# EAGLE design navx_micro_4_1 (EAGLE 6.5.0)
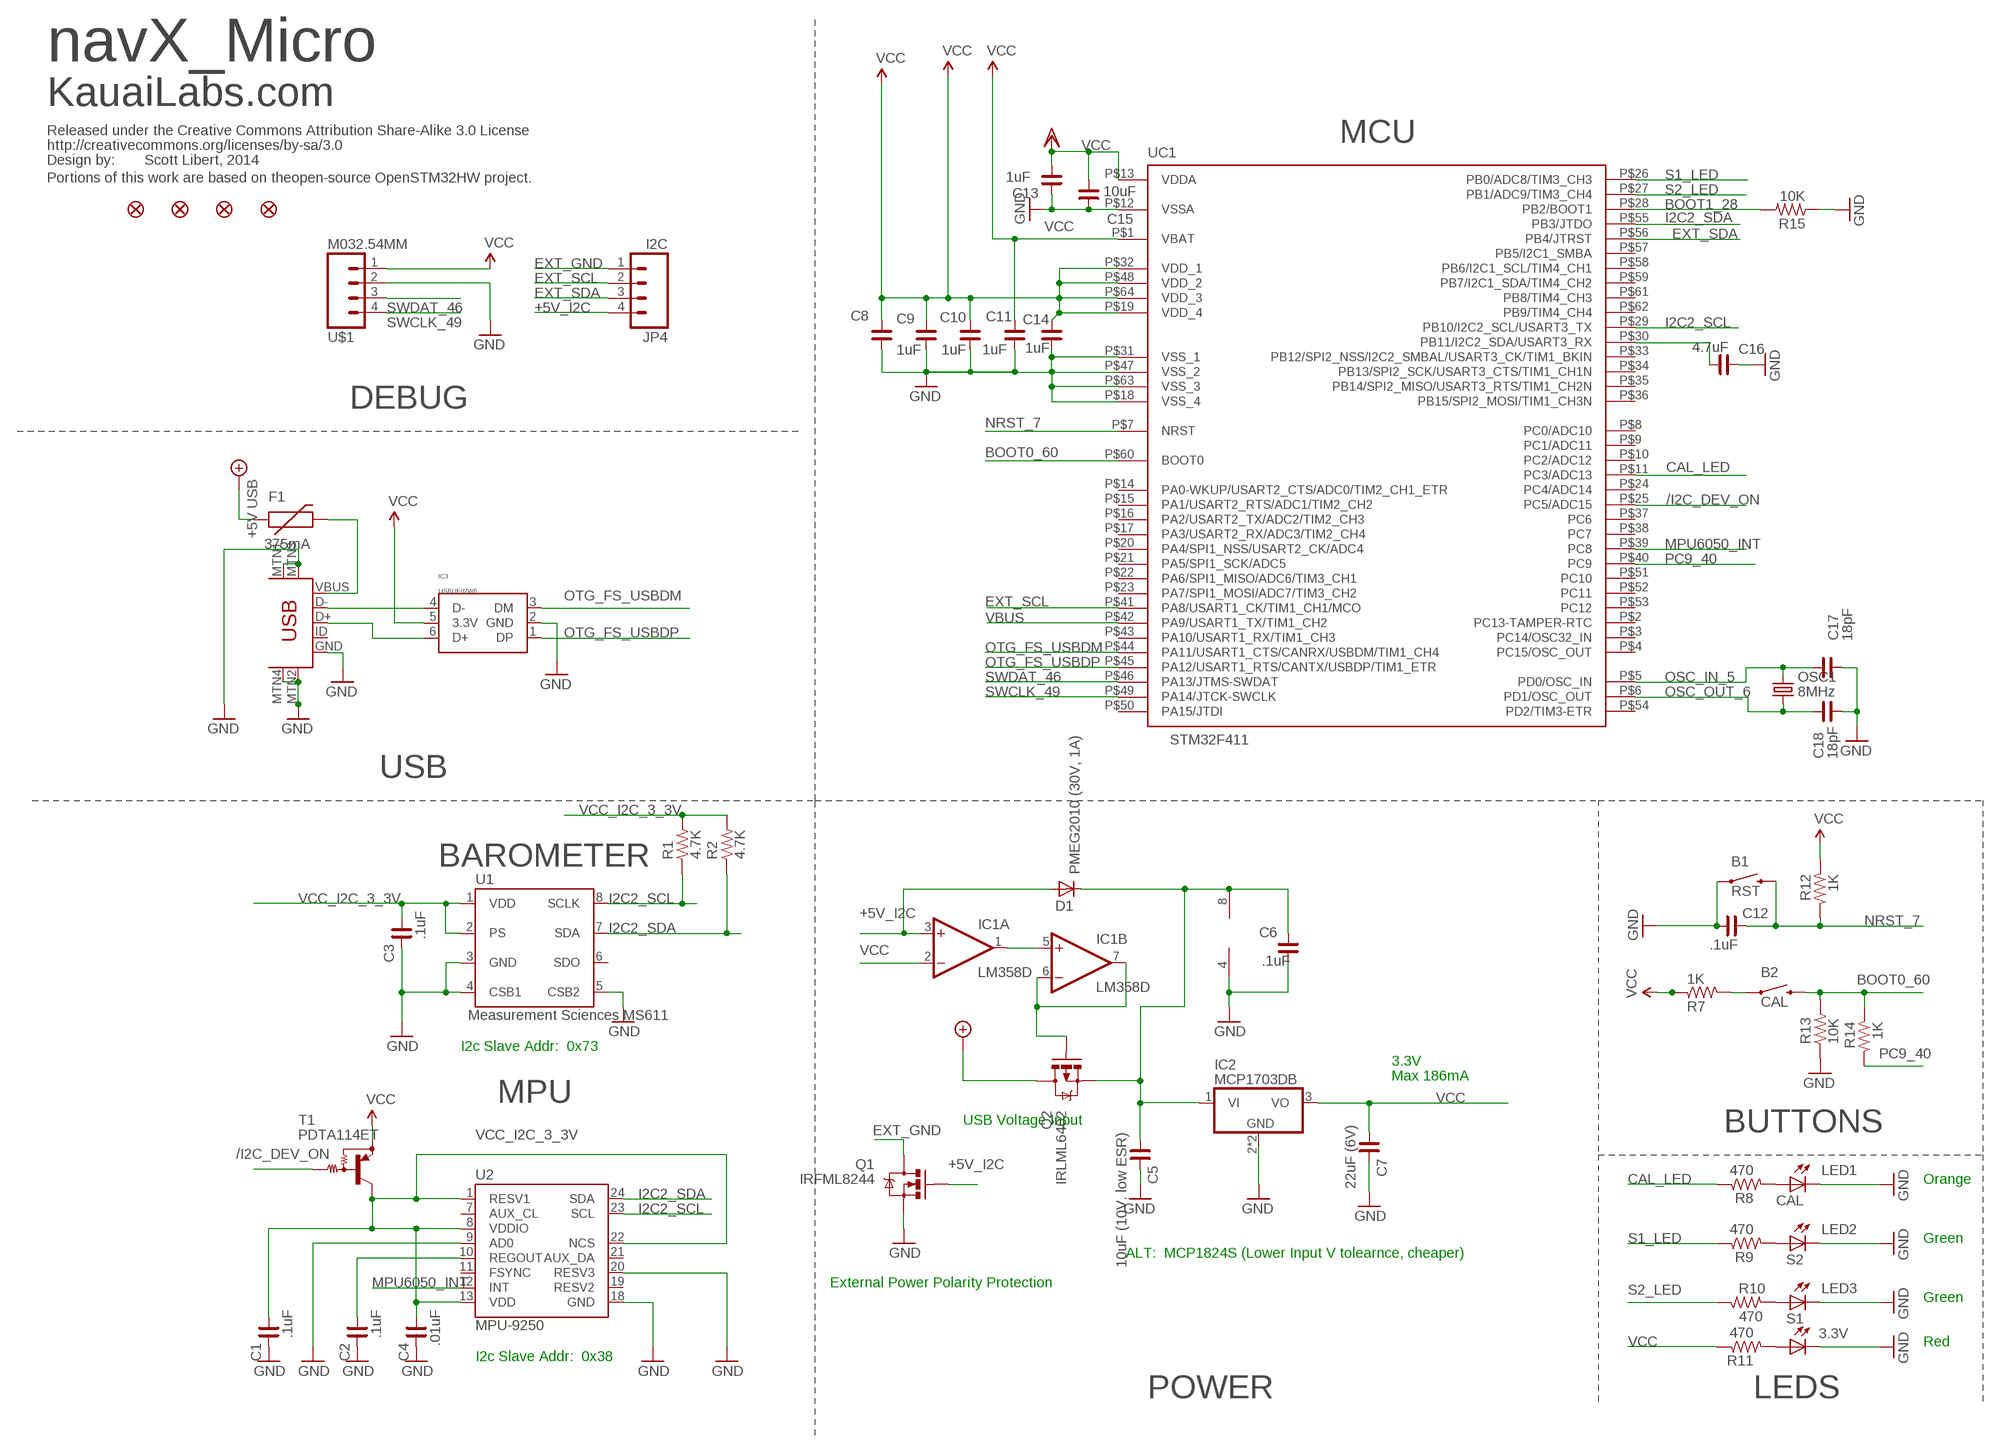
[diagram p0: schematic, sheet 1]

## Parts
B1  RST  SWITCH-MOMENTARY-2-SMD-1101NE  [TACTILE-SWITCH-1101NE]
B2  CAL  SWITCH-MOMENTARY-2-SMD-1101NE  [TACTILE-SWITCH-1101NE]
C1  .1uF  C_0603  [C0603]
C2  .1uF  C_0603  [C0603]
C3  .1uF  C_0603  [C0603]
C4  .01uF  C_0603  [C0603]
C5  10uF (10V. low ESR)  C_0805  [C0805]
C6  .1uF  C_0603  [C0603]
C7  22uF (6V)  C_0805  [C0805]
C8  1uF  C_0603  [C0603]
C9  1uF  C_0603  [C0603]
C10  1uF  C_0603  [C0603]
C11  1uF  C_0603  [C0603]
C12  .1uF  C_0603  [C0603]
C13  1uF  C_0603  [C0603]
C14  1uF  C_0603  [C0603]
C15  10uF  C_0805  [C0805]
C16  4.7uF  C_0603  [C0603]
C17  18pF  C_0603  [C0603]
C18  18pF  C_0603  [C0603]
D1  PMEG2010 (30V, 1A)  DIODESOD-323  [SOD-323]
F1  375mA  PTC0603  [0603]
IC1  LM358D  [SO08]
IC2  MCP1703DB  [MCP1703DB]
IC3  USBUF02W6  [SC70-6]
JP4  I2C  M04PTH  [1X04]
JP21  FIDUCIAL1X2  [FIDUCIAL-1X2]
JP22  FIDUCIAL1X2  [FIDUCIAL-1X2]
JP23  FIDUCIAL1X2  [FIDUCIAL-1X2]
JP24  FIDUCIAL1X2  [FIDUCIAL-1X2]
LED1  CAL  LEDCHIP-LED0603  [CHIP-LED0603]
LED2  S2  LEDCHIP-LED0603  [CHIP-LED0603]
LED3  S1  LEDCHIP-LED0603  [CHIP-LED0603]
LED4  3.3V  LEDCHIP-LED0603  [CHIP-LED0603]
LICENSE_TEXT  CREATIVE_COMMONS  [CREATIVE_COMMONS]
OSC1  8MHz  CRYSTAL5X3  [CRYSTAL-SMD-5X3]
Q1  IRFML8244  MOSFET-NCHANNELBSS123LT1G  [SOT23]
Q2  IRLML6402  MOSFET-PCHANNELSMD  [SOT23-3]
R1  4.7K  R_0603  [R0603]
R2  4.7K  R_0603  [R0603]
R7  1K  R_0603  [R0603]
R8  470  R_0603  [R0603]
R9  470  R_0603  [R0603]
R10  470  R_0603  [R0603]
R11  470  R_0603  [R0603]
R12  1K  R_0603  [R0603]
R13  10K  R_0603  [R0603]
R14  1K  R_0603  [R0603]
R15  10K  R_0603  [R0603]
T1  PDTA114ET  PNP-DRIVERSOT23-3  [SOT23-3]
U1  Measurement Sciences MS611  MS5611  [MS5611]
U2  MPU-9250  [QFN24_3MM_INVENSENSE]
U$1  M032.54MM  M041X04_NO_SILK  [1X04_NO_SILK]
UC1  STM32F411  STM32F103  [TQFP-10X10-64]
USB  Mini-USB  USB-MINIB-5PIN  [USB-MINIB]

## Nets
+5V [vcc]: F1.1 Q2.3(D) ; supply symbol labelled +5V USB
+5V_I2C: D1.A IC1.3(A:+IN) JP4.4 Q1.1(G)
/I2C_DEV_ON: T1.1(B) UC1.P$25(PC5/ADC15)
BOOT0_60: B2.P$2 R13.2 R14.1 UC1.P$60(BOOT0)
BOOT1_28: R15.2 UC1.P$28(PB2/BOOT1)
CAL_LED: R8.1 UC1.P$11(PC3/ADC13)
EXT_GND: JP4.1 Q1.3(D)
EXT_SCL: JP4.2 UC1.P$41(PA8/USART1_CK/TIM1_CH1/MCO)
EXT_SDA: JP4.3 UC1.P$56(PB4/JTRST)
GND: B1.P$1 C1.2 C2.2 C3.2 C4.2 C5.2 C6.1 C7.2 C8.1 C9.1 C10.1 C11.1 C12.1 C13.1 C14.1 C15.2 C16.1 C17.1 C18.1 IC1.4(P:V-) IC2.2(GND) IC2.4(GND) IC3.2(GND) LED1.C LED2.C LED3.C LED4.C Q1.2(S) R13.1 R15.1 U1.3(GND) U1.4(CSB1) U1.5(CSB2) U2.9(AD0) U2.18(GND) U2.20(RESV3) U$1.2 UC1.P$12(VSSA) UC1.P$18(VSS_4) UC1.P$31(VSS_1) UC1.P$47(VSS_2) UC1.P$63(VSS_3) USB.GND USB.MTN1(MTN2) USB.MTN2(MTN3) USB.MTN3(MTN1) USB.MTN4
I2C2_SCL: R1.1 U1.8(SCLK) U2.23(SCL) UC1.P$29(PB10/I2C2_SCL/USART3_TX)
I2C2_SDA: R2.1 U1.7(SDA) U2.24(SDA) UC1.P$55(PB3/JTDO)
MPU6050_INT: U2.12(INT) UC1.P$39(PC8)
N$1: C2.1 U2.10(REGOUT)
N$2: B2.P$1 R7.2
N$3: LED3.A R10.1
N$4: C16.2 UC1.P$30(PB11/I2C2_SDA/USART3_RX)
N$5: LED2.A R9.2
N$7: C5.1 C6.2 D1.C IC1.8(P:V+) IC2.1(VI) Q2.2(S)
N$9: IC1.1(A:OUT) IC1.5(B:+IN)
N$10: IC1.6(B:-IN) IC1.7(B:OUT) Q2.1(G)
N$11: LED1.A R8.2
N$14: IC3.4(D-) USB.D-
N$17: IC3.6(D+) USB.D+
N$18: LED4.A R11.2
NRST_7: B1.P$2 C12.2 R12.2 UC1.P$7(NRST)
OSC_IN_5: C17.2 OSC1.3 UC1.P$5(PD0/OSC_IN)
OSC_OUT_6: C18.2 OSC1.1 UC1.P$6(PD1/OSC_OUT)
OTG_FS_USBDM: IC3.3(DM) UC1.P$44(PA11/USART1_CTS/CANRX/USBDM/TIM1_CH4)
OTG_FS_USBDP: IC3.1(DP) UC1.P$45(PA12/USART1_RTS/CANTX/USBDP/TIM1_ETR)
PC9_40: R14.2 UC1.P$40(PC9)
S1_LED: R9.1 UC1.P$26(PB0/ADC8/TIM3_CH3)
S2_LED: R10.2 UC1.P$27(PB1/ADC9/TIM3_CH4)
SWCLK_49: U$1.4 UC1.P$49(PA14/JTCK-SWCLK)
SWDAT_46: U$1.3 UC1.P$46(PA13/JTMS-SWDAT)
VBUS: F1.2 UC1.P$42(PA9/USART1_TX/TIM1_CH2) USB.VBUS
VCC [vcc]: C7.1 C8.2 C9.2 C10.2 C11.2 C13.2 C14.2 C15.1 IC1.2(A:-IN) IC2.3(VO) IC3.5(3.3V) R7.1 R11.1 R12.1 T1.2(E) U$1.1 UC1.P$1(VBAT) UC1.P$13(VDDA) UC1.P$19(VDD_4) UC1.P$32(VDD_1) UC1.P$48(VDD_2) UC1.P$64(VDD_3) ; supply symbol labelled VDD
VCC_I2C_3_3V [vcc]: C1.1 C3.1 C4.1 R1.2 R2.2 T1.3(C) U1.1(VDD) U1.2(PS) U2.1(RESV1) U2.8(VDDIO) U2.13(VDD) U2.22(NCS)
Unconnected: U1.6(SDO) U2.7(AUX_CL) U2.11(FSYNC) U2.19(RESV2) U2.21(AUX_DA) UC1.P$2(PC13-TAMPER-RTC) UC1.P$3(PC14/OSC32_IN) UC1.P$4(PC15/OSC_OUT) UC1.P$8(PC0/ADC10) UC1.P$9(PC1/ADC11) UC1.P$10(PC2/ADC12) UC1.P$14(PA0-WKUP/USART2_CTS/ADC0/TIM2_CH1_ETR) UC1.P$15(PA1/USART2_RTS/ADC1/TIM2_CH2) UC1.P$16(PA2/USART2_TX/ADC2/TIM2_CH3) UC1.P$17(PA3/USART2_RX/ADC3/TIM2_CH4) UC1.P$20(PA4/SPI1_NSS/USART2_CK/ADC4) UC1.P$21(PA5/SPI1_SCK/ADC5) UC1.P$22(PA6/SPI1_MISO/ADC6/TIM3_CH1) UC1.P$23(PA7/SPI1_MOSI/ADC7/TIM3_CH2) UC1.P$24(PC4/ADC14) UC1.P$33(PB12/SPI2_NSS/I2C2_SMBAL/USART3_CK/TIM1_BKIN) UC1.P$34(PB13/SPI2_SCK/USART3_CTS/TIM1_CH1N) UC1.P$35(PB14/SPI2_MISO/USART3_RTS/TIM1_CH2N) UC1.P$36(PB15/SPI2_MOSI/TIM1_CH3N) UC1.P$37(PC6) UC1.P$38(PC7) UC1.P$43(PA10/USART1_RX/TIM1_CH3) UC1.P$50(PA15/JTDI) UC1.P$51(PC10) UC1.P$52(PC11) UC1.P$53(PC12) UC1.P$54(PD2/TIM3-ETR) UC1.P$57(PB5/I2C1_SMBA) UC1.P$58(PB6/I2C1_SCL/TIM4_CH1) UC1.P$59(PB7/I2C1_SDA/TIM4_CH2) UC1.P$61(PB8/TIM4_CH3) UC1.P$62(PB9/TIM4_CH4) USB.ID

## Notes on the sheet
- navX_Micro
- KauaiLabs.com
- MCU
- Scott Libert, 2014
- Portions of this work are based on theopen-source OpenSTM32HW project.
- DEBUG
- USB
- BAROMETER
- I2c Slave Addr:  0x73
- 3.3V
- Max 186mA
- MPU
- USB Voltage Input
- BUTTONS
- Orange
- Green
- ALT:  MCP1824S (Lower Input V tolearnce, cheaper)
- External Power Polarity Protection
- Green
- Red
- I2c Slave Addr:  0x38
- POWER | LEDS

## Library data of the parts
B1 B2 = SparkFun_20110922_my:SWITCH-MOMENTARY-2
C1 C2 C4 C6 C9-C18 = rc-master-smd:C_: NON-POLARIZED CAP
C3 = rc-master-smd:C_: NON-POLARIZED CAP; DIGIKEY_PART_NUMBER: 399-1096-1-ND
C5 C7 = rc-master-smd:C_: NON-POLARIZED CAP; DIGIKEY_PART_NUMBER: 399-1158-1-ND
C8 = rc-master-smd:C_: NON-POLARIZED CAP; DIGIKEY_PART_NUMBER: 399-3118-1-ND
D1 = adafruit:DIODE: Diode SMADIODE - SMA Surface Mount Package 20V 1A Schottky Diode Digikey: 641-1014-6-ND DO-1N4148 - Through Hole Small Current Diode SOD-123 20V 1 A (.5mV Vf) Schottky Diode - Digikey: MBRX120TPMSCT-ND SOD-323 10V 570mA (.38mV Vf, 3ns) Schottky Diode - Digikey: ZLLS410CT-ND SOD-523 30V 30mA Schottky Diode (RB751S-40TE61) - Digikey: RB751S-40TE61CT-ND SOT23-R/W - SOT23 Package (R = Solder Paste/Reflow Ovens, W = Hand-Soldering) BAT54Film 40V 300mA - Digikey: 497-7162-1-ND
F1 = SparkFun:PTC: Resettable Fuse PTC Resettable Fuse. Spark Fun Electronics SKU : COM-08357
IC1 = linear:LM358: OP AMP also LM158; LM258; LM2904 Source: http://cache.national.com/ds/LM/LM158.pdf
IC2 = KauaiFusionLabs:MCP1703DB; DIGIKEY_PART_NUMBER: MCP1703T-3302E/DBCT-ND
IC3 = es:USBUF; DIGIKEY_PART_NUMBER: 497-3743-1-ND
JP4 U$1 = SparkFun-Connectors:M04: Header 4 Standard 4-pin 0.1" header. Use with straight break away headers (SKU : PRT-00116), right angle break away headers (PRT-00553), swiss pins (PRT-00743), machine pins (PRT-00117), and female headers (PRT-00115). Molex polarized connector foot print use with SKU : PRT-08231 with associated crimp pins and housings. 1MM SMD Version SKU: PRT-10208
JP21-JP24 = SparkFun-Aesthetics:FIDUCIAL: Fiducial Alignment Points Various fiducial points for machine vision alignment.
LED1-LED4 = led:LED: LED OSRAM: - CHIPLED LG R971, LG N971, LY N971, LG Q971, LY Q971, LO R971, LY R971 LH N974, LH R974 LS Q976, LO Q976, LY Q976 LO Q996 - Hyper CHIPLED LW Q18S LB Q993, LB Q99A, LB R99A - SideLED LS A670, LO A670, LY A670, LG A670, LP A670 LB A673, LV A673, LT A673, LW A673 LH A674 LY A675 LS A676, LA A676, LO A676, LY A676, LW A676 LS A679, LY A679, LG A679 - Hyper Micro SIDELED® LS Y876, LA Y876, LO Y876, LY Y876 LT Y87S - SmartLED LW L88C, LW L88S LB L89C, LB L89S, LG L890 LS L89K, LO L89K, LY L89K LS L896, LA L896, LO L896, LY L896 - TOPLED LS T670, LO T670, LY T670, LG T670, LP T670 LSG T670, LSP T670, LSY T670, LOP T670, LYG T670 LG T671, LOG T671, LSG T671 LB T673, LV T673, LT T673, LW T673 LH T674 LS T676, LA T676, LO T676, LY T676, LB T676, LH T676, LSB T676, LW T676 LB T67C, LV T67C, LT T67C, LS T67K, LO T67K, LY T67K, LW E67C LS E67B, LA E67B, LO E67B, LY E67B, LB E67C, LV E67C, LT E67C LW T67C LS T679, LY T679, LG T679 LS T770, LO T770, LY T770, LG T770, LP T770 LB T773, LV T773, LT T773, LW T773 LH T774 LS E675, LA E675, LY E675, LS T675 LS T776, LA T776, LO T776, LY T776, LB T776 LHGB T686 LT T68C, LB T68C - Hyper Mini TOPLED® LB M676 - Mini TOPLED Santana® LG M470 LS M47K, LO M47K, LY M47K Source: http://www.osram.convergy.de LUXEON: - LUMILED® LXK2-PW12-R00, LXK2-PW12-S00, LXK2-PW14-U00, LXK2-PW14-V00 LXK2-PM12-R00, LXK2-PM12-S00, LXK2-PM14-U00 LXK2-PE12-Q00, LXK2-PE12-R00, LXK2-PE12-S00, LXK2-PE14-T00, LXK2-PE14-U00 LXK2-PB12-K00, LXK2-PB12-L00, LXK2-PB12-M00, LXK2-PB14-N00, LXK2-PB14-P00, LXK2-PB14-Q00 LXK2-PR12-L00, LXK2-PR12-M00, LXK2-PR14-Q00, LXK2-PR14-R00 LXK2-PD12-Q00, LXK2-PD12-R00, LXK2-PD12-S00 LXK2-PH12-R00, LXK2-PH12-S00 LXK2-PL12-P00, LXK2-PL12-Q00, LXK2-PL12-R00 Source: www.luxeon.com KINGBRIGHT: KA-3528ASYC Source: www.kingbright.com
LICENSE_TEXT = SparkFun:CREATIVE_COMMONS
OSC1 = SparkFun:CRYSTAL: Crystals Various standard crystals. Proven footprints. Spark Fun Electronics SKU : COM-00534
Q1 = SparkFun-DiscreteSemi:MOSFET-NCHANNEL: Common NMOSFET Parts MFG P/N Store ID Prod ID FDD8780 TRANS-09984 SI7820DN TRANS-11055 FDS6630A IC-08089 2N7002PW TRANS-11151 FQP30N06L COM-10213 TRANS-10060 BSS123LT1G TRANS-08345 BSS138 TRANS-00830 BS170 2N7000; DIGIKEY_PART_NUMBER: DMN3404LDICT-ND; PROD_ID: TRANS-08345
Q2 = SparkFun-DiscreteSemi:MOSFET-PCHANNEL: Generic PMOSFET
R1 R2 R7-R15 = rc-master-smd:R_: RESISTOR
T1 = es:PNP-DRIVER
U1 = KauaiFusionLabs:MS5611; DIGIKEY_PART_NUMBER: MPL115A2-ND
U2 = KauaiFusionLabs:MPU-9250; DESCRIPTRION: IC MOTION PROCESSOR 24-QFN; DIGIKEY_PART_NUMBER: 1428-1019-1-ND; MANUFACTURER: INVENSENSE
UC1 = st-microelectronics:STM32F103; DIGIKEY_PART_NUMBER: 497-11154-ND
USB = SparkFun_20110922_my:USB-MINIB: Mini-USB "B" connector with 5th pin broken out. Created new symbol breaking out 5th "ID" pin in mini/micro USB connector spec. See: http://en.wikipedia.org/wiki/Mini_usb#Cables. Uses same footprint as 4-pin symbol. Also added pins to connect to mounting / shield pads if required (probably not generally needed as signals aren't shielded once they leave the connector).; DIGIKEY_PART_NUMBER: 151-1206-1-ND

## Net classes
2 RF: width 0.635 mm, clearance 0.762 mm

## Board
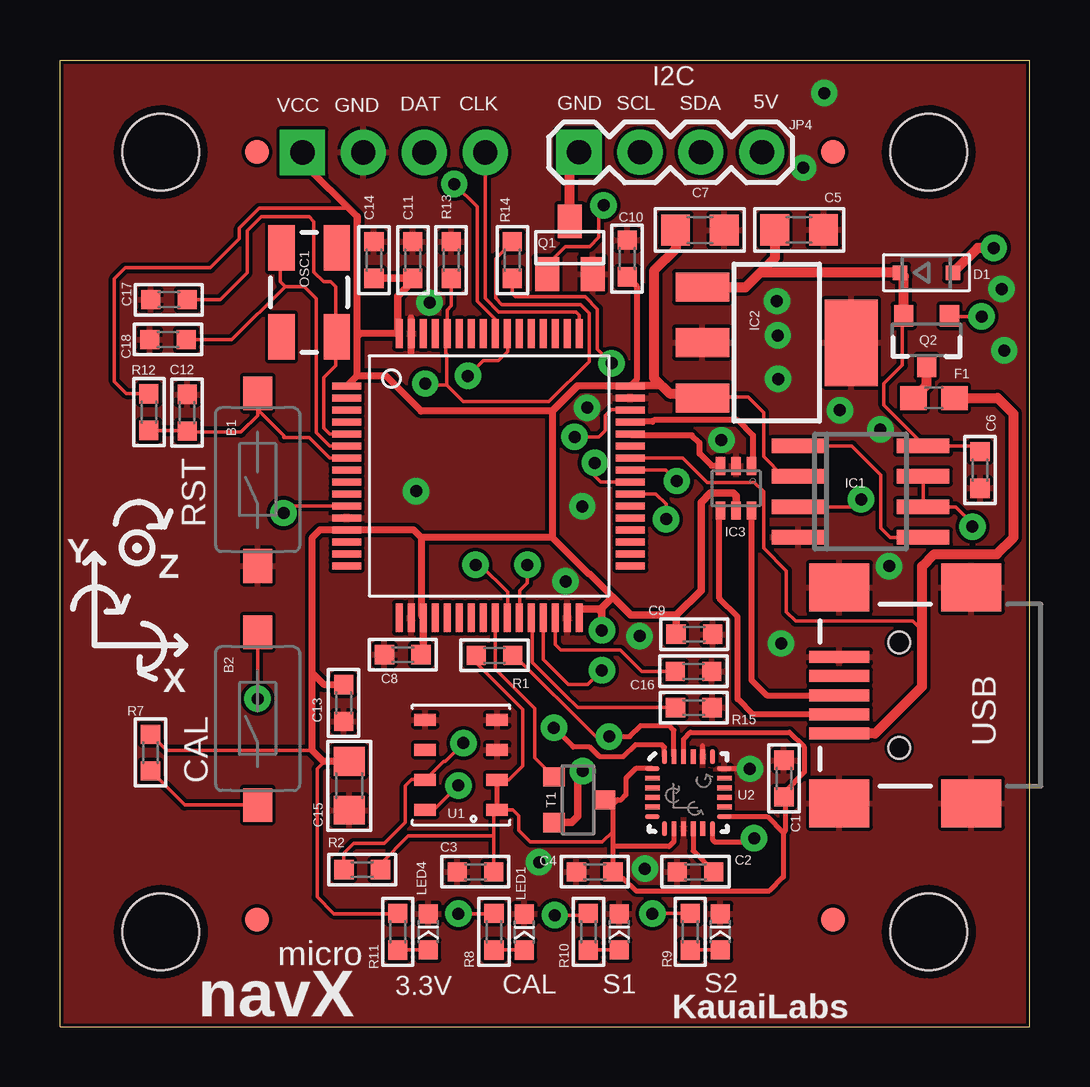
[diagram p1: board, top side]
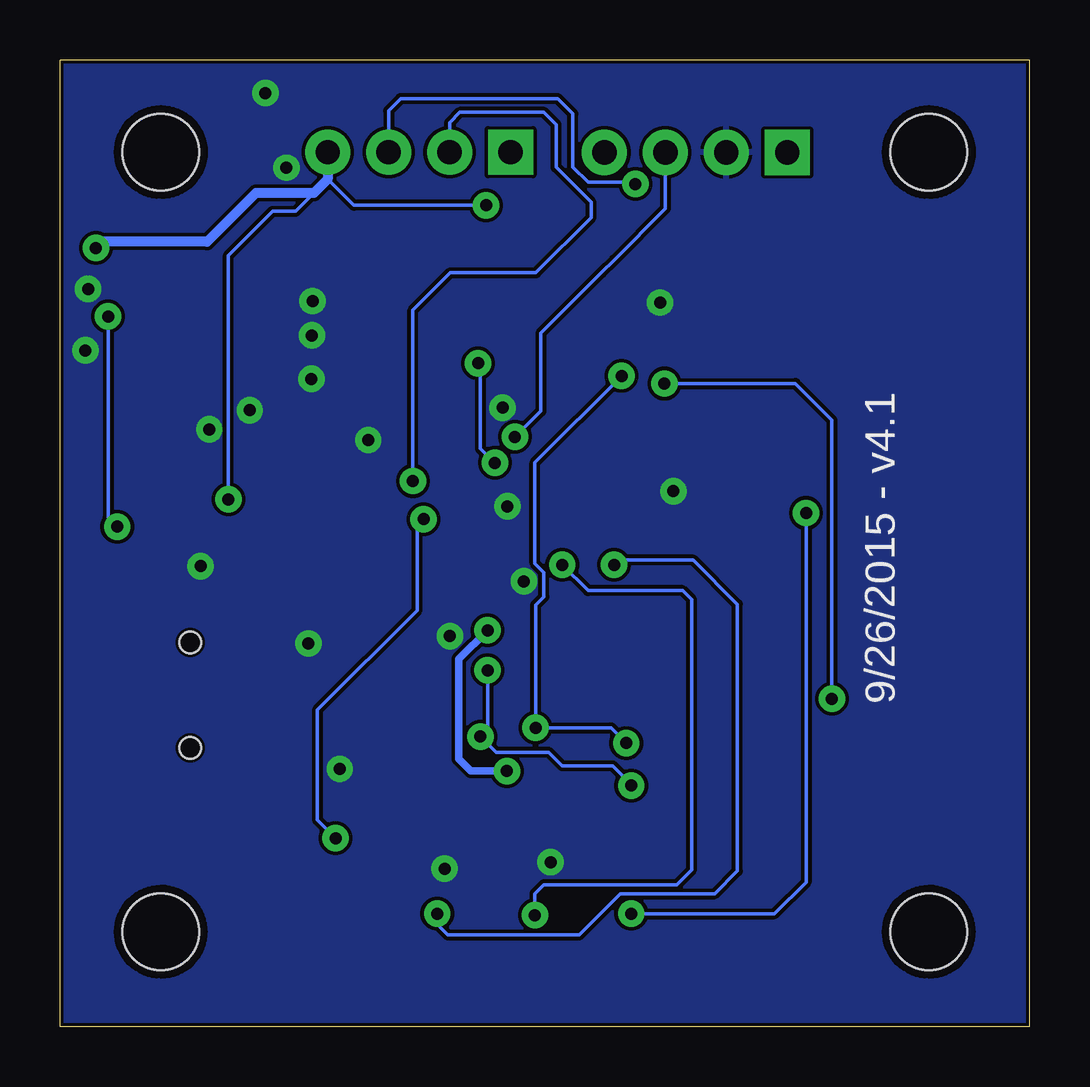
[diagram p2: board, bottom side, seen from below]

Size 40.4 x 40.3 mm. Coordinates in mm from the lower left corner, seen from the top.
Outline: 0,0 40.4,0 40.4,40.3 0,40.3 0,0
Copper layers (1*16): Top 0.018mm / dielectric 1.5mm / Bottom 0.018mm
Design rules "es-015mm *": minimum track width 0.15mm, minimum drill 0.4mm, track to track 0.15mm, track to pad 0.15mm, pad to pad 0.15mm, via to via 0.15mm, smd to smd 0.15mm, copper to edge 0.15mm, drill to drill 0.15mm, minimum pad ring 0.4mm, minimum via ring 0.3mm, stop-mask expansion 0mil, vias tented up to drill 25mil, thermal gap 0.15mm

### Footprints (pad centres in the part's own frame; a part is rotated, then mirrored left to right if it is on the bottom)
TACTILE-SWITCH-1101NE = smd 1.4 x 1.2: P$1 -3.6,0; P$2 3.6,0
C0603 = smd 0.8 x 0.8: 1 -0.762,0; 2 0.762,0
C0805 = smd 1.2 x 1.3: 1 -1.016,0; 2 1.016,0
SOD-323 = smd 0.6 x 0.6: A 1.1,0; C -1.1,0
0603 = smd 1.1 x 1: 1 -0.85,0; 2 0.85,0
SO08 = smd 0.6 x 2.2: 1 -1.905,-2.6; 2 -0.635,-2.6; 3 0.635,-2.6; 4 1.905,-2.6; 5 1.905,2.6; 6 0.635,2.6; 7 -0.635,2.6; 8 -1.905,2.6
MCP1703DB = smd 1.219 x 2.235: 1 -2.311,-3.099; 2 0,-3.099; 3 2.311,-3.099 | smd 3.6 x 2.2: 4 0,3.099
SC70-6 = smd 0.4 x 0.75: 1 -0.65,-0.925; 2 0,-0.925; 3 0.65,-0.925; 4 0.65,0.925; 5 0,0.925; 6 -0.65,0.925
1X04 = drill 1.016 pad 1.88 square: 1 0,0 | drill 1.016 pad 1.88: 2 2.54,0; 3 5.08,0; 4 7.62,0
FIDUCIAL-1X2 = smd 1 x 1: 1 0,0
CHIP-LED0603 = smd 0.8 x 0.8: A 0,-0.75; C 0,0.75
CRYSTAL-SMD-5X3 = smd 1.9 x 1.1: 1 -1.85,-1.15; 2 1.85,-1.15; 3 1.85,1.15; 4 -1.85,1.15
SOT23 = smd 1 x 1.4: 1 -0.95,-1.1; 2 0.95,-1.1; 3 0,1.1
SOT23-3 = smd 0.8 x 0.9: 1 -0.95,-1; 2 0.95,-1; 3 0,1.1
R0603 = smd 0.8 x 0.8: 1 -0.762,0; 2 0.762,0
MS5611 = smd 0.9 x 0.5: 1 -1.5,1.875; 2 -1.5,0.625; 3 -1.5,-0.625; 4 -1.5,-1.875; 5 1.5,-1.875; 6 1.5,-0.625; 7 1.5,0.625; 8 1.5,1.875
QFN24_3MM_INVENSENSE = smd 0.6 x 0.2: 1 -1.5,1; 2 -1.5,0.6; 3 -1.5,0.2; 4 -1.5,-0.2; 5 -1.5,-0.6; 6 -1.5,-1; 13 1.5,-1; 14 1.5,-0.6; 15 1.5,-0.2; 16 1.5,0.2; 17 1.5,0.6; 18 1.5,1 | smd 0.2 x 0.6: 7 -1,-1.5; 8 -0.6,-1.5; 9 -0.2,-1.5; 10 0.2,-1.5; 11 0.6,-1.5; 12 1,-1.5; 19 1,1.5; 20 0.6,1.5; 21 0.2,1.5; 22 -0.2,1.5; 23 -0.6,1.5; 24 -1,1.5
1X04_NO_SILK = drill 1.016 pad 1.88 square: 1 0,0 | drill 1.016 pad 1.88: 2 2.54,0; 3 5.08,0; 4 7.62,0
MXP_STANDOFF_REAR = hole 3.2: 0,0
TQFP-10X10-64 = smd 1.2 x 0.3: P$1 -5.936,3.75; P$2 -5.936,3.25; P$3 -5.936,2.75; P$4 -5.936,2.25; P$5 -5.936,1.75; P$6 -5.936,1.25; P$7 -5.936,0.75; P$8 -5.936,0.25; P$9 -5.936,-0.25; P$10 -5.936,-0.75; P$11 -5.936,-1.25; P$12 -5.936,-1.75; P$13 -5.936,-2.25; P$14 -5.936,-2.75; P$15 -5.936,-3.25; P$16 -5.936,-3.75; P$33 5.886,-3.75; P$34 5.886,-3.25; P$35 5.886,-2.75; P$36 5.886,-2.25; P$37 5.886,-1.75; P$38 5.886,-1.25; P$39 5.886,-0.75; P$40 5.886,-0.25; P$41 5.886,0.25; P$42 5.886,0.75; P$43 5.886,1.25; P$44 5.886,1.75; P$45 5.886,2.25; P$46 5.886,2.75; P$47 5.886,3.25; P$48 5.886,3.75 | smd 0.3 x 1.2: P$17 -3.75,-5.911; P$18 -3.25,-5.911; P$19 -2.75,-5.911; P$20 -2.25,-5.911; P$21 -1.75,-5.911; P$22 -1.25,-5.911; P$23 -0.75,-5.911; P$24 -0.25,-5.911; P$25 0.25,-5.911; P$26 0.75,-5.911; P$27 1.25,-5.911; P$28 1.75,-5.911; P$29 2.25,-5.911; P$30 2.75,-5.911; P$31 3.25,-5.911; P$32 3.75,-5.911; P$49 3.75,5.936; P$50 3.25,5.936; P$51 2.75,5.936; P$52 2.25,5.936; P$53 1.75,5.936; P$54 1.25,5.936; P$55 0.75,5.936; P$56 0.25,5.936; P$57 -0.25,5.936; P$58 -0.75,5.936; P$59 -1.25,5.936; P$60 -1.75,5.936; P$61 -2.25,5.936; P$62 -2.75,5.936; P$63 -3.25,5.936; P$64 -3.75,5.936
USB-MINIB = smd 2.5 x 0.5: D+ 2.5,0; D- 2.5,0.8; GND 2.5,-1.6; ID 2.5,-0.8; VBUS 2.5,1.6 | smd 2.5 x 2: MTN1 -3,4.5; MTN2 2.5,4.5; MTN3 -3,-4.5; MTN4 2.5,-4.5 | hole 0.9: 0,2.2; 0,-2.2

### Placement (x,y rotation side)
B1  8.24,22.81 90 top
B2  8.24,12.84 90 top
C1  30.16,10.35 90 top
C2  26.48,6.46 180 top
C3  17.31,6.46 180 top
C4  22.28,6.46 180 top
C5  30.8,33.22 0 top
C6  38.33,23.21 90 top
C7  26.66,33.21 0 top
C8  14.28,15.51 0 top
C9  26.43,16.36 180 top
C10  23.63,32.02 270 top
C11  14.7,31.96 270 top
C12  5.3,25.6 270 top
C13  11.82,13.49 90 top
C14  13.08,31.96 270 top
C15  12.05,10.04 270 top
C16  26.39,14.81 180 top
C17  4.54,30.31 0 top
C18  4.5,28.64 0 top
D1  36.1,31.43 0 top
F1  36.41,26.21 0 top
IC1  33.36,22.31 270 top
IC2  29.87,28.51 270 top
IC3  28.17,22.44 180 top
JP4  21.62,36.45 0 top
JP21  8.2,4.46 90 top
JP22  8.2,36.46 0 top
JP23  32.2,36.46 0 top
JP24  32.2,4.46 0 top
LED1  19.34,3.95 0 top
LED2  27.51,3.96 0 top
LED3  23.3,3.96 0 top
LED4  15.35,3.96 0 top
LICENSE_TEXT  49.55,63.47 180 top  (outside the outline)
OSC1  10.38,30.61 270 top
Q1  21.24,32.47 0 top
Q2  36.11,28.64 180 top
R1  18.1,15.48 180 top
R2  12.59,6.55 0 top
R7  3.77,11.43 270 top
R8  18.08,3.96 270 top
R9  26.26,3.96 270 top
R10  22.02,3.96 90 top
R11  14.07,3.96 270 top
R12  3.7,25.62 270 top
R13  16.3,31.96 270 top
R14  18.84,31.96 270 top
R15  26.41,13.3 180 top
T1  21.58,9.46 270 top
U1  16.71,10.92 180 top
U2  26.18,9.76 0 top
U$1  10.1,36.45 0 top
U$2  [MXP_STANDOFF_REAR]  36.2,36.46 0 bottom
U$3  [MXP_STANDOFF_REAR]  36.2,3.96 0 top
U$4  [MXP_STANDOFF_REAR]  4.2,3.96 0 top
U$7  [MXP_STANDOFF_REAR]  4.2,36.46 0 bottom
UC1  17.88,22.96 0 top
USB  34.97,13.82 180 top

### Tracks (layer width: path | path; a pad name or v marks a point on that pad's centre or on a via)
+5V
  Top 0.406: F1.1 36.11,26.75 Q2.3
+5V_I2C  (via drill 0.5)
  Top 0.15: IC1.3 33.07,21.67 v33.38,21.98 | Q1.1 20.29,31.76 21.06,32.53 22.08,32.53 22.46,32.91 22.46,34.05 v22.65,34.24
  Top 0.406: v38.91,32.46 38.24,32.46 D1.A
  Bottom 0.15: v33.38,21.98 33.38,32.15 31.54,33.99 30.59,33.99 29.25,35.33 28.16,34.24 v22.65,34.24
  Bottom 0.406: v38.91,32.46 38.65,32.72 34.27,32.72 32.24,34.75 29.82,34.75 29.25,35.33 JP4.4
/I2C_DEV_ON
  Top 0.15: UC1.P$25 18.13,14.91 19.78,13.26 19.78,11.21 T1.1
BOOT0_60  (via drill 0.5)
  Top 0.15: 16.18,28.84 UC1.P$60 | UC1.P$60 16.08,28.84 16.08,28.06 16.11,28.03 16.11,26.75 | 16.11,26.75 16.8,26.06 20.37,26.06 22.04,27.73 22.04,29.75 21.69,30.1 18.42,30.1 18.15,30.37 18.15,32.03 R14.1 | 16.11,26.75 15.28,26.75 v15.22,26.81 | UC1.P$60 16.13,29.88 16.3,30.05 R13.2 | v8.23,13.67 B2.P$2
  Bottom 0.15: v15.22,26.81 9.76,26.81 8.23,25.29 v8.23,13.67
BOOT1_28
  Top 0.15: UC1.P$28 19.68,17 19.68,15.19 20.71,14.17 21.02,13.86 21.57,13.3 R15.2
CAL_LED  (via drill 0.5)
  Top 0.15: UC1.P$11 9.61,21.71 v9.31,21.41 | v16.6,4.71 R8.1
  Bottom 0.15: v9.31,21.41 9.31,6.03 10.63,4.71 v16.6,4.71
EXT_GND
  Top 0.406: Q1.3 21.24,36.07 JP4.1
EXT_SCL  (via drill 0.5)
  Top 0.15: UC1.P$41 25.24,23.21 v25.7,22.75
  Bottom 0.15: v25.7,22.75 25.7,29.87 24.14,31.42 20.57,31.42 18.27,33.73 18.27,34.37 19.73,35.83 19.73,37.61 20.23,38.11 23.73,38.11 24.17,37.68 JP4.2
EXT_SDA  (via drill 0.5)
  Top 0.15: UC1.P$56 18.13,29.49 17.38,30.24 17.38,34.18 v16.43,35.13
  Bottom 0.15: v16.43,35.13 16.49,35.2 18.4,35.2 19.03,35.83 19.03,38.05 19.66,38.69 26.21,38.69 26.71,38.18 26.71,36.46 JP4.3
GND  (via drill 0.5)
  Top 0.2: U2.20 26.78,11.71 | U2.18 v28.74,10.76 v28.74,10.75
  Top 0.3: 14.63,28.11 14.63,29.56
  Bottom 0.2: v28.74,10.75 28.87,10.75 28.87,10.37
  other vias: 14.84,22.33 24.15,16.29 15.4,30.18 27.56,24.45 34.18,24.9 32.49,25.7 29.91,28.82 29.92,27.01 30.97,35.81 21.76,21.69 29.87,30.25 39.23,30.75 21.07,18.56 39.34,28.19 24.37,6.59 19.96,6.86 34.55,19.2 30.05,15.98 21.96,25.8 31.84,38.92
  pour Bottom: 40.4,40.3 40.4,0 0,0 0,40.3
  pour Top: 0,0 0,40.3 40.4,40.3 40.4,0
I2C2_SCL  (via drill 0.5)
  Top 0.15: UC1.P$29 20.13,15.31 21.18,14.26 21.98,14.26 v22.58,14.86 | U1.8 15.58,9.04 v16.6,10.06 | R1.1 18.93,15.48 22.32,12.1 v22.88,12.1
  Top 0.2: v22.88,12.1 23.74,12.1 24.19,12.54 25.4,12.54 25.58,12.36 U2.23
  Bottom 0.15: v22.58,14.86 22.58,12.39 v22.88,12.1 22.23,11.44 20.04,11.44 19.47,10.87 17.38,10.87 16.6,10.09 v16.6,10.06
I2C2_SDA  (via drill 0.5)
  Top 0.15: UC1.P$55 18.65,28.88 18.65,28.14 18.27,27.76 17.63,27.76 v17,27.13 | v16.81,11.83 16.04,11.06 15.98,11.06 U1.7 15.2,10.3 14.65,10.3 14.39,10.05 14.39,8.52 13.5,7.63 12.23,7.63 11.83,7.23 R2.1
  Top 0.2: v20.58,12.46 21.38,11.66 22.07,11.66 22.47,11.26 23.48,11.26 23.98,11.76 25.06,11.76 25.18,11.64 U2.24
  Bottom 0.15: v16.81,11.83 17.44,12.46 v20.58,12.46 20.58,17.58 20.23,17.92 20.23,18.94 20.62,19.32 20.62,23.51 v17,27.13
MPU6050_INT  (via drill 0.5)
  Top 0.15: UC1.P$39 24.83,22.21 25.25,21.79 v25.25,21.16
  Top 0.2: U2.12 27.18,7.8 27.28,7.7 28.76,7.7 v28.92,7.86
  Bottom 0.15: v28.92,7.86 29.68,8.62 29.68,13.2 25.53,17.36 25.53,20.89 v25.25,21.16
N$1
  Top 0.2: U2.10 26.38,7.32 C2.1
N$2
  Top 0.15: B2.P$1 5.2,9.24 R7.2
N$3
  Top 0.15: R10.1 23.29,3.2 LED3.A
N$4
  Top 0.15: UC1.P$30 20.63,15.94 20.87,15.7 23.35,15.7 24.24,14.81 C16.2
N$5
  Top 0.15: R9.2 27.5,3.2 LED2.A
N$7
  Top 0.15: C6.2 38.09,24.21 IC1.8 35.96,24.3 34.33,25.92 34.33,26.81 35.09,27.57 35.09,29.57 Q2.2
  Top 0.406: Q2.2 35.16,31.27 D1.C 29.17,31.43 | IC2.1 28.57,30.83 29.17,31.43 | C5.1 29.78,32.04 29.17,31.43
N$9
  Top 0.15: IC1.1 32.99,24.21 34.2,23 34.2,20.78 34.59,20.4 IC1.5
N$10  (via drill 0.5)
  Top 0.15: v38.02,20.84 38.02,20.97 37.32,21.67 IC1.6 | IC1.6 | IC1.6 IC1.7 | v38.4,29.61 37.09,29.61 Q2.1
  Bottom 0.15: v38.4,29.61 38.4,21.22 v38.02,20.84
N$11
  Top 0.15: R8.2 LED1.A
N$14
  Top 0.254: IC3.4 27.47,21.47 27.47,17.86 28.24,17.09 28.24,13.65 28.87,13.02 USB.D-
N$17
  Top 0.254: USB.D+ 29.44,13.82 28.81,14.46 28.81,21.5 IC3.6
N$18
  Top 0.15: R11.2 15.34,3.2 LED4.A
NRST_7
  Top 0.15: UC1.P$7 11.23,23.71 10.38,24.56 9.32,24.56 9.32,24.64 8.23,25.73 | 4.03,24.54 R12.2 5.27,24.86 C12.2 5.35,24.78 7.54,24.78 8.23,25.48 8.23,25.73 | 8.23,25.73 B1.P$2
OSC_IN_5
  Top 0.15: 11.43,28.86 OSC1.3 | OSC1.3 11.48,28.71 11.48,27.56 10.98,27.06 10.98,24.96 11.23,24.71 UC1.P$5 | OSC1.3 11.48,28.81 11.48,30.86 11.28,31.06 10.98,31.06 10.58,31.46 10.58,33.56 10.38,33.76 8.38,33.76 7.8,33.18 7.8,31.42 6.68,30.31 C17.2
OSC_OUT_6
  Top 0.15: UC1.P$6 11.23,24.21 10.68,24.76 10.68,30.36 10.18,30.86 9.38,30.86 | 9.03,32.66 OSC1.1 9.18,32.41 9.18,31.06 9.38,30.86 | C18.2 7.17,28.64 9.38,30.86
OTG_FS_USBDM
  Top 0.254: UC1.P$44 23.82,24.65 26.33,24.65 26.65,24.33 26.65,23.88 27.15,23.38 27.5,23.38 IC3.3
OTG_FS_USBDP
  Top 0.254: IC3.1 28.87,23.42 28.87,24.65 28.24,25.29 24.74,25.29 24.68,25.22 23.78,25.22 UC1.P$45
PC9_40  (via drill 0.5)
  Top 0.15: UC1.P$40 22.53,22.71 22.28,22.96 v22.28,23.5 | 22.98,27.76 v22.98,27.66 22.39,28.24 22.39,29.92 21.89,30.43 18.96,30.43 18.84,30.56 R14.2
  Bottom 0.15: v22.98,27.66 22.88,27.56 22.88,24.1 v22.28,23.5
S1_LED  (via drill 0.5)
  Top 0.15: v17.31,19.26 17.5,19.26 18.65,18.11 18.65,17.06 UC1.P$26 | R9.1 v24.69,4.72 v24.68,4.71
  Bottom 0.15: v17.31,19.26 17.12,19.45 14.01,19.45 12.17,17.6 12.17,6.49 13.12,5.54 17.06,5.54 18.77,3.83 24.24,3.83 24.68,4.27 v24.68,4.71
S2_LED  (via drill 0.5)
  Top 0.15: v19.47,19.26 19.47,18.49 19.16,18.18 19.16,17.07 UC1.P$27 | v20.62,4.65 21.95,4.65 R10.2
  Bottom 0.15: v19.47,19.26 18.39,18.18 14.46,18.18 14.08,17.8 14.08,6.55 14.71,5.92 20.23,5.92 20.62,5.54 v20.62,4.65
SWCLK_49
  Top 0.15: UC1.P$49 21.63,29.67 21.5,29.8 18.29,29.8 17.72,30.37 U$1.4
SWDAT_46  (via drill 0.5)
  Top 0.15: UC1.P$46 23.79,25.73 22.97,25.73 22.71,25.48 22.71,24.84 22.46,24.59 v21.44,24.59
  Bottom 0.15: 15.14,36.41 U$1.3 15.18,34.1 17.31,31.96 17.31,31.95 17.84,31.42 17.85,31.42 20.37,28.91 20.37,25.66 v21.44,24.59
VBUS
  Top 0.15: UC1.P$42 25.94,23.71 26.97,22.68 28.93,22.68 29.32,22.3 29.32,19.95 30.27,19 30.27,17.29 30.65,16.91 35.54,16.91 35.92,16.52
  Top 0.406: USB.VBUS 33.96,12.22 35.92,14.17 35.92,16.52 35.92,19.19 36.43,19.7 39.03,19.7 39.73,20.4 39.73,25.54 39.06,26.21 F1.2
VCC  (via drill 0.5)
  Top 0.15: 10.52,11.51 4.46,11.51 R7.1 | R12.1 2.77,26.4 2.26,26.9 2.26,31.19 2.71,31.64 6.27,31.64 7.47,32.84 7.47,33.29 8.3,34.11 12.02,34.11 12.38,33.76 | C15.1 11.02,11.06 10.71,10.75 10.71,5.41 11.41,4.71 R11.1 | IC1.2 30.14,22.94 29.32,23.76 29.32,25.6 28.68,26.24 26.8,26.24 IC2.3
  Top 0.254: 23.78,26.72 23.78,26.74 24.05,27 24.05,30.85 C10.2
  Top 0.3: UC1.P$32 21.63,17.41 | UC1.P$48 21.56,26.71 | UC1.P$19 15.08,17.1 15.08,20.37 15.05,20.4 | 12.07,11.04 C15.1 10.97,11.06 10.52,11.51 10.52,14.75 | 12.38,27.14 12.38,28.76 | 12.38,28.76 12.38,33.56 | 12.38,27.14 UC1.P$1 | 12.38,27.14 13.56,27.14 15.05,25.66 20.51,25.66 20.51,20.4 | UC1.P$64 12.52,28.89 12.38,28.76 | 23.03,17.91 22.05,18.89 22.02,18.89 20.51,20.4 | 15.13,16.02 15.13,15.6 C8.2 | 20.51,20.4 15.05,20.4 | 15.05,20.4 14.74,20.71 UC1.P$13 10.83,20.71 10.52,20.4 10.52,14.75 | C13.2 11.01,14.26 10.52,14.75 | U$1.1 10.1,36.04 12.38,33.76
  Top 0.305: v22.58,16.52 22.58,17.26 | T1.2 21.33,8.51 21.58,8.76 21.58,10.46 v21.78,10.66 | 21.63,17.41 22.43,17.41 22.58,17.26 | 22.58,17.26 22.58,17.46 23.03,17.91 23.78,17.16 25.68,17.16 | UC1.P$48 23.78,26.72 25.07,26.72 25.4,26.4 | 20.51,25.66 21.56,26.71 | C9.2 25.67,17.15 25.68,17.16 | UC1.P$64 14.08,28.94 14.08,30.46 14.58,30.96 14.58,31.08 C11.2 C14.2 | UC1.P$19 15.13,16.02 | 12.38,33.56 12.38,33.76 | 12.04,11.04 C15.1 | 25.68,17.16 26.71,18.19 26.71,21.86 27.09,22.24 28.05,22.24 28.17,22.11 IC3.5
  Top 0.406: IC2.3 26.57,26.4 25.4,26.4 24.74,27.05 24.74,31.51 25.65,32.41 C7.1
  Bottom 0.305: v21.78,10.66 23.28,10.66 23.78,11.16 23.78,15.32 v22.58,16.52
VCC_I2C_3_3V
  Top 0.15: 23.04,8.14 22.6,7.7 19.6,7.7 19.11,8.19 19.11,8.8 18.87,9.04 U1.1 18.07,8.9 18.07,7.95 | 18.07,7.95 C3.1 | U1.2 18.7,10.29 19.28,10.87 19.28,13.22 17.34,15.16 R1.2 | R2.2 13.36,6.79 14.52,7.95 18.07,7.95
  Top 0.2: U2.1 23.98,10.76 23.58,10.36 23.58,9.66 23.38,9.46 23.22,9.46 | T1.3 23.22,9.46 | U1.1 U1.2 | U2.13 29.46,8.76 30.14,8.08 | C4.1 23.04,7.51 | 23.04,7.51 23.04,8.14 23.04,9.28 23.22,9.46 | U2.8 25.58,7.71 25.38,7.51 23.04,7.51 | 30.21,9.54 C1.1 | 30.14,8.08 30.14,6.24 29.57,5.67 23.98,5.67 23.47,6.17 23.33,6.17 C4.1 | 30.21,9.54 30.21,8.15 30.14,8.08 | C4.1 23.04,6.42 | 30.21,9.54 30.21,9.8 31.03,10.62 31.03,11.63 30.4,12.27 26.27,12.27 25.98,11.98 U2.22

### Text on the board
tPlace: DAT | CLK | GND | 5V | Y | Z | X | navX | KauaiLabs
bPlace: 9/26/2015 - v4.1
tNames: VCC | GND | SCL | SDA | micro | 3.3V | CAL
Reference: Scott Libert, 6/2015